# Altium schematic sheet motordriver-v3.1_IO.SchDoc
size A
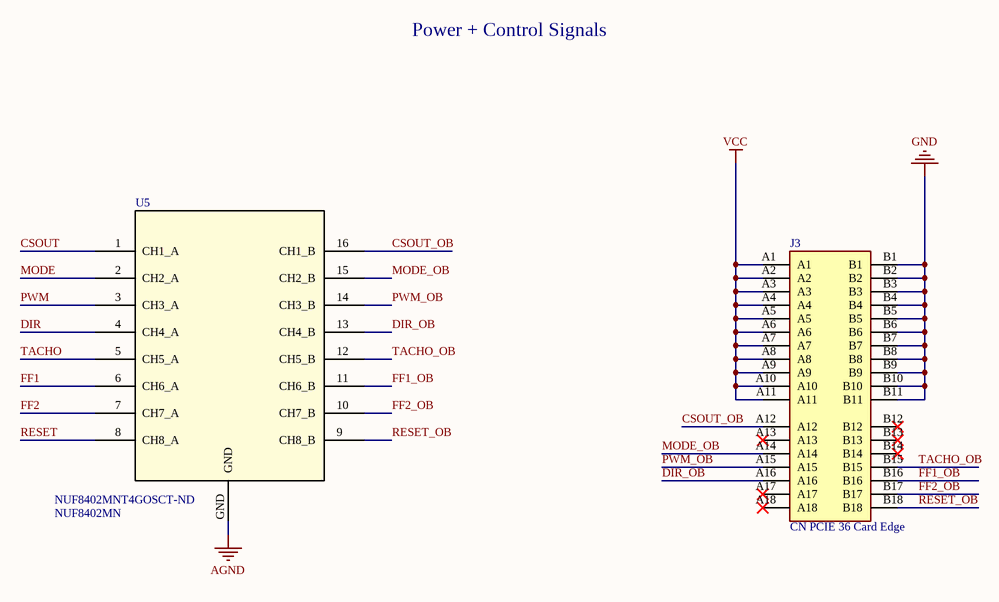
[diagram p0: motordriver-v3.1_IO.SchDoc]

## Parts
J3  CN PCIE 36 Card Edge  [CN PCIE EDGE 36CKT]
U5  NUF8402MN  Supplier Part Number 1: NUF8402MNT4GOSCT-ND  [SON50P160X100_HS-17M]

## Nets
AGND: U5.GND
GND: J3.B1 J3.B2 J3.B3 J3.B4 J3.B5 J3.B6 J3.B7 J3.B8 J3.B9 J3.B10 J3.B11
VCC: J3.A1 J3.A2 J3.A3 J3.A4 J3.A5 J3.A6 J3.A7 J3.A8 J3.A9 J3.A10 J3.A11
CSOUT: U5.1(CH1_A)
CSOUT_OB: J3.A12 U5.16(CH1_B)
DIR: U5.4(CH4_A)
DIR_OB: J3.A16 U5.13(CH4_B)
FF1: U5.6(CH6_A)
FF1_OB: J3.B16 U5.11(CH6_B)
FF2: U5.7(CH7_A)
FF2_OB: J3.B17 U5.10(CH7_B)
MODE: U5.2(CH2_A)
MODE_OB: J3.A14 U5.15(CH2_B)
PWM: U5.3(CH3_A)
PWM_OB: J3.A15 U5.14(CH3_B)
RESET: U5.8(CH8_A)
RESET_OB: J3.B18 U5.9(CH8_B)
TACHO: U5.5(CH5_A)
TACHO_OB: J3.B15 U5.12(CH5_B)

Not connected (* = marked no-connect by the designer): J3 A13* A17* A18* B12* B13* B14*

## Notes on the sheet
- Power + Control Signals

## Library data of the parts
J3 = CN PCIE 36 Card Edge: 36 Position Male PCIE Connector
U5 = EMI FILTER NUF8402MN: EMI Filter 8ch 105Mhz 100Ohm; Supplier 1: Digi-Key